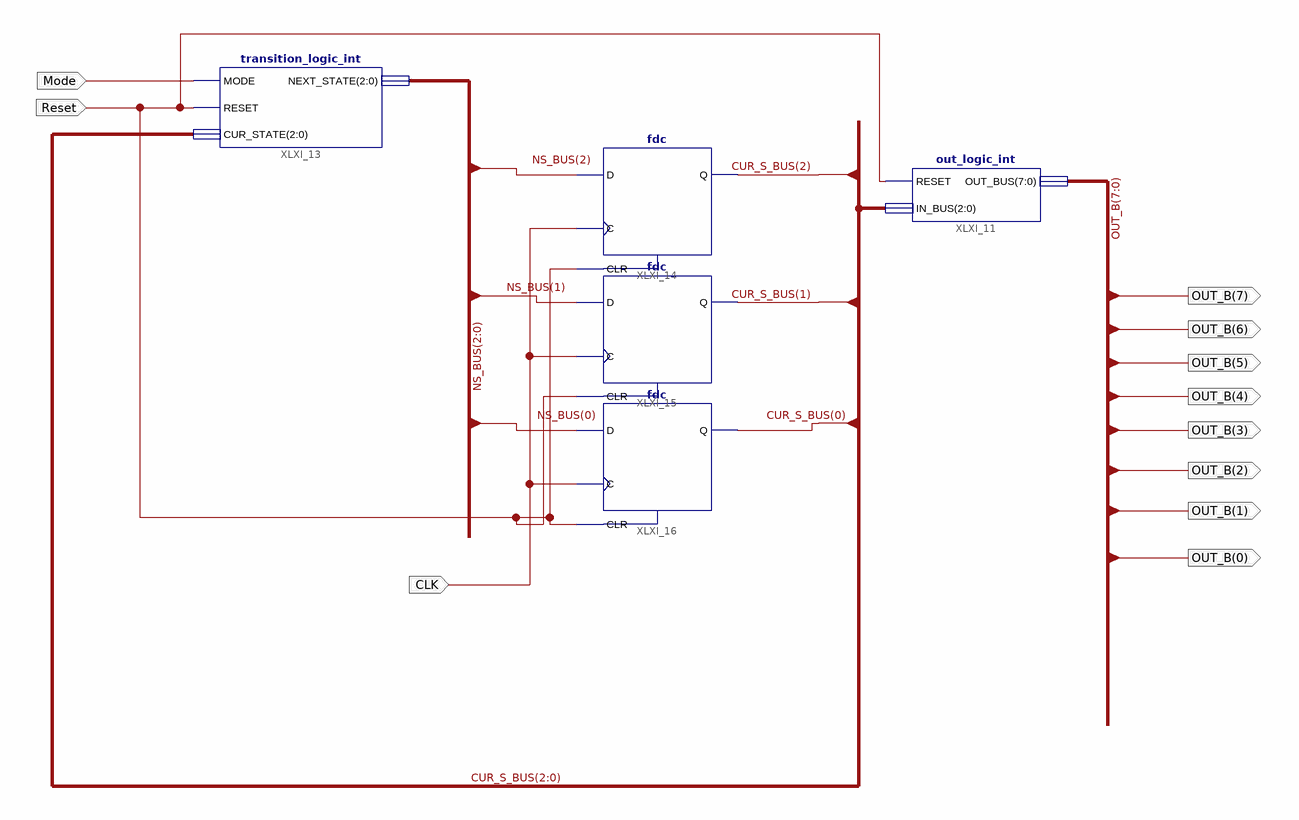
[diagram p0: schematic sheet 1]
// Xilinx ISE schematic LightController.sch (spartan3a) as structural Verilog: 5 symbols, 11 ports
module LightController (
  input  Mode,
  input  Reset,
  input  CLK,
  output [7:0] OUT_B
);

  wire [2:0] CUR_S_BUS, NS_BUS;

  out_logic_int XLXI_11 (.RESET(Reset), .IN_BUS(CUR_S_BUS), .OUT_BUS(OUT_B));
  transition_logic_int XLXI_13 (.MODE(Mode), .RESET(Reset), .CUR_STATE(CUR_S_BUS), .NEXT_STATE(NS_BUS));
  fdc XLXI_14 (.C(CLK), .CLR(Reset), .D(NS_BUS[2]), .Q(CUR_S_BUS[2]));
  fdc XLXI_15 (.C(CLK), .CLR(Reset), .D(NS_BUS[1]), .Q(CUR_S_BUS[1]));
  fdc XLXI_16 (.C(CLK), .CLR(Reset), .D(NS_BUS[0]), .Q(CUR_S_BUS[0]));
endmodule
